# EAGLE schematic Trackerv4 (EAGLE 9.4.2)

## Sheet 1 of 5: Main MCU
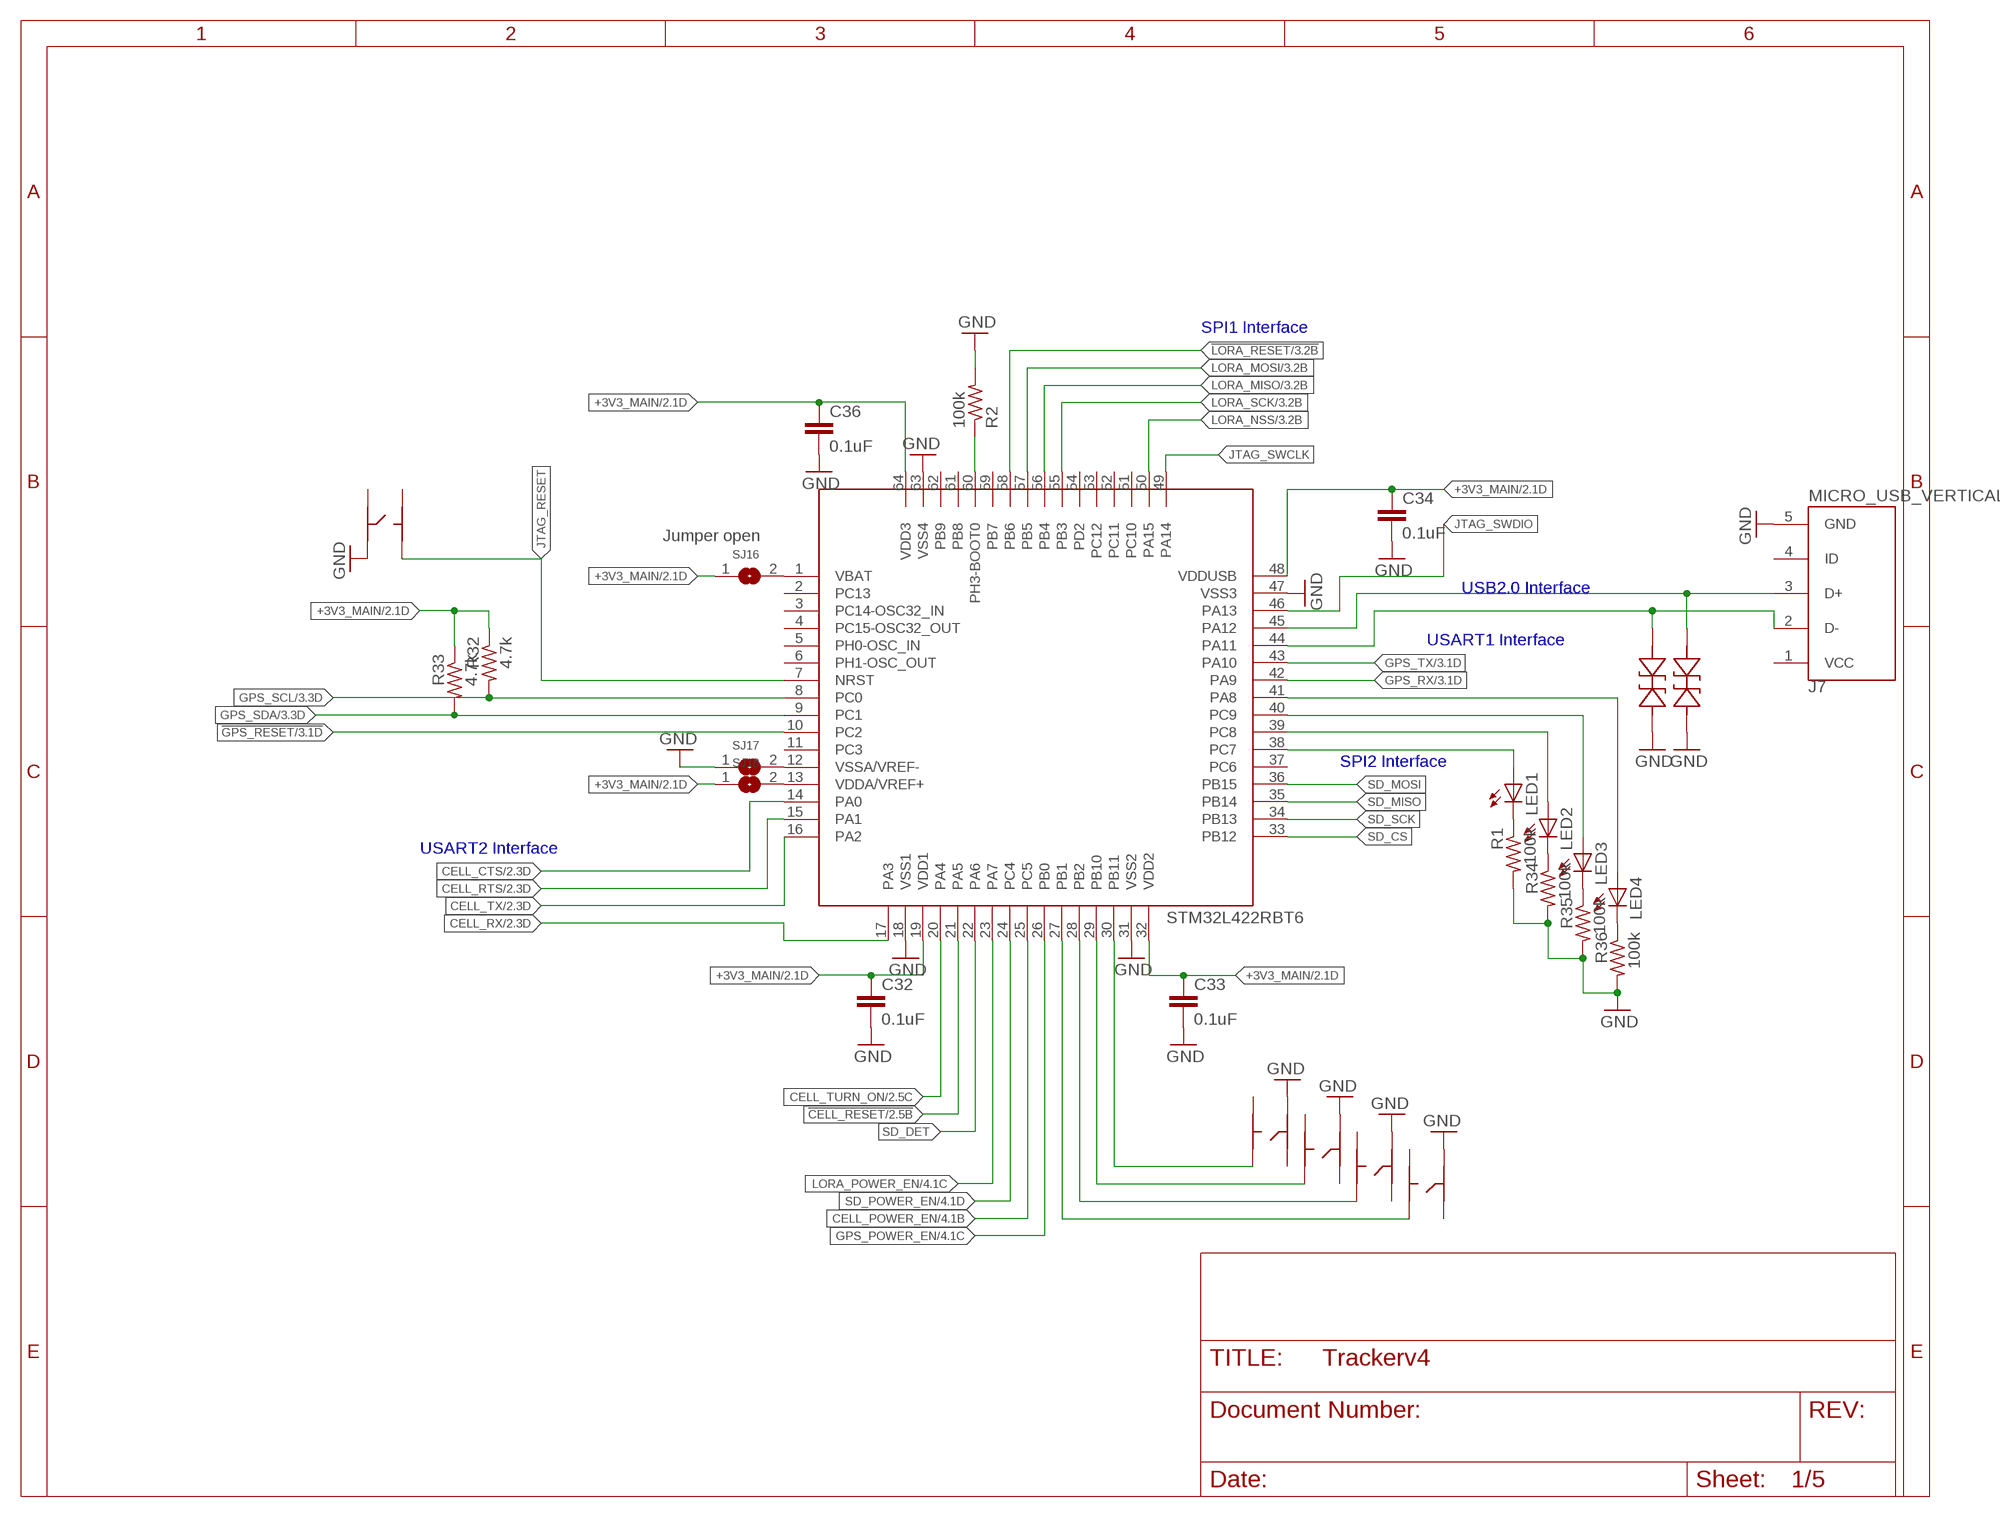
[diagram p0: schematic, sheet 1]

### Parts
C32  0.1uF  C-EUC0402  [C0402]
C33  0.1uF  C-EUC0402  [C0402]
C34  0.1uF  C-EUC0402  [C0402]
C36  0.1uF  C-EUC0402  [C0402]
CR7  PESD0402-140  [PESD0402]
CR8  PESD0402-140  [PESD0402]
J7  MICRO_USB_VERTICAL  [MICRO_USB_VERTICAL]
LED1  LEDCHIP-LED0603  [CHIP-LED0603]
LED2  LEDCHIP-LED0603  [CHIP-LED0603]
LED3  LEDCHIP-LED0603  [CHIP-LED0603]
LED4  LEDCHIP-LED0603  [CHIP-LED0603]
R1  100k  R-US_R0402  [R0402]
R2  100k  R-US_R0402  [R0402]
R32  4.7k  R-US_R0402  [R0402]
R33  4.7k  R-US_R0402  [R0402]
R34  100k  R-US_R0402  [R0402]
R35  100k  R-US_R0402  [R0402]
R36  100k  R-US_R0402  [R0402]
S1  KMR731NG  [KMR731NG]
S2  KMR731NG  [KMR731NG]
S3  KMR731NG  [KMR731NG]
S4  KMR731NG  [KMR731NG]
S5  KMR731NG  [KMR731NG]
SJ16  SOLDERJUMPERREFLOW_NOPASTE  [SOLDERJUMPER_REFLOW_NOPASTE]
SJ17  SOLDERJUMPERREFLOW_NOPASTE  [SOLDERJUMPER_REFLOW_NOPASTE]
SJ18  SOLDERJUMPERREFLOW_NOPASTE  [SOLDERJUMPER_REFLOW_NOPASTE]
U$1  STM32L422RBT6  [QFP50P1200X1200X160-64]

### Nets
!CELL_RESET: U$1.21(PA5) ; also sheet 2
!GPS_RESET: U$1.10(PC2) ; also sheet 3
!LORA_RESET: U$1.58(PB6) ; also sheet 3,5
+3V3_MAIN: C32.1 C33.1 C34.1 C36.1 R32.1 R33.1 SJ16.1 SJ18.1 U$1.19(VDD1) U$1.32(VDD2) U$1.48(VDDUSB) U$1.64(VDD3) ; also sheet 2,4,5
CELL_CTS: U$1.14(PA0) ; also sheet 2,5
CELL_POWER_EN: U$1.25(PC5) ; also sheet 4
CELL_RTS: U$1.15(PA1) ; also sheet 2,5
CELL_RX: U$1.17(PA3) ; also sheet 2,5
CELL_TURN_ON: U$1.20(PA4) ; also sheet 2
CELL_TX: U$1.16(PA2) ; also sheet 2,5
GND: C32.2 C33.2 C34.2 C36.2 CR7.1 CR8.1 J7.5(GND) R1.2 R2.2 R34.2 R35.2 R36.2 S1.P$1 S2.P$1 S3.P$1 S4.P$1 S5.P$1 SJ17.1 U$1.18(VSS1) U$1.31(VSS2) U$1.47(VSS3) U$1.63(VSS4) ; also sheet 2,3,4,5
GPS_POWER_EN: U$1.26(PB0) ; also sheet 4
GPS_RX: U$1.42(PA9) ; also sheet 3,5
GPS_SCL: R32.2 U$1.8(PC0) ; also sheet 3,5
GPS_SDA: R33.2 U$1.9(PC1) ; also sheet 3,5
GPS_TX: U$1.43(PA10) ; also sheet 3,5
JTAG_RESET: S1.P$4 U$1.7(NRST) ; also sheet 5
JTAG_SWCLK: U$1.49(PA14) ; also sheet 5
JTAG_SWDIO: U$1.46(PA13) ; also sheet 5
LORA_MISO: U$1.56(PB4) ; also sheet 3,5
LORA_MOSI: U$1.57(PB5) ; also sheet 3,5
LORA_NSS: U$1.50(PA15) ; also sheet 3,5
LORA_POWER_EN: U$1.23(PA7) ; also sheet 4
LORA_SCK: U$1.55(PB3) ; also sheet 3,5
MCU_USB_N [diff]: CR7.2 J7.2(D-) U$1.44(PA11)
MCU_USB_P [diff]: CR8.2 J7.3(D+) U$1.45(PA12)
N$1: R2.1 U$1.60(PH3-BOOT0)
N$68: SJ16.2 U$1.1(VBAT)
N$69: SJ17.2 U$1.12(VSSA/VREF-)
N$70: SJ18.2 U$1.13(VDDA/VREF+)
N$83: S5.P$3 U$1.27(PB1)
N$84: S4.P$3 U$1.28(PB2)
N$85: S3.P$3 U$1.29(PB10)
N$86: S2.P$3 U$1.30(PB11)
N$87: LED1.C R1.1
N$88: LED2.C R34.1
N$89: LED3.C R35.1
N$90: LED4.C R36.1
N$92: LED1.A U$1.38(PC7)
N$93: LED2.A U$1.39(PC8)
N$94: LED3.A U$1.40(PC9)
N$95: LED4.A U$1.41(PA8)
SD_CS: U$1.33(PB12) ; also sheet 2
SD_DET: U$1.22(PA6) ; also sheet 2
SD_MISO: U$1.35(PB14) ; also sheet 2
SD_MOSI: U$1.36(PB15) ; also sheet 2
SD_POWER_EN: U$1.24(PC4) ; also sheet 4
SD_SCK: U$1.34(PB13) ; also sheet 2
Unconnected: J7.1(VCC) J7.4(ID) S1.P$2 S1.P$3 S2.P$2 S2.P$4 S3.P$2 S3.P$4 S4.P$2 S4.P$4 S5.P$2 S5.P$4 U$1.2(PC13) U$1.3(PC14-OSC32_IN) U$1.4(PC15-OSC32_OUT) U$1.5(PH0-OSC_IN) U$1.6(PH1-OSC_OUT) U$1.11(PC3) U$1.37(PC6) U$1.51(PC10) U$1.52(PC11) U$1.53(PC12) U$1.54(PD2) U$1.59(PB7) U$1.61(PB8) U$1.62(PB9)

### Notes on the sheet
- SPI1 Interface
- Jumper open
- USB2.0 Interface
- USART1 Interface
- SPI2 Interface
- USART2 Interface

## Sheet 2 of 5: Cellular
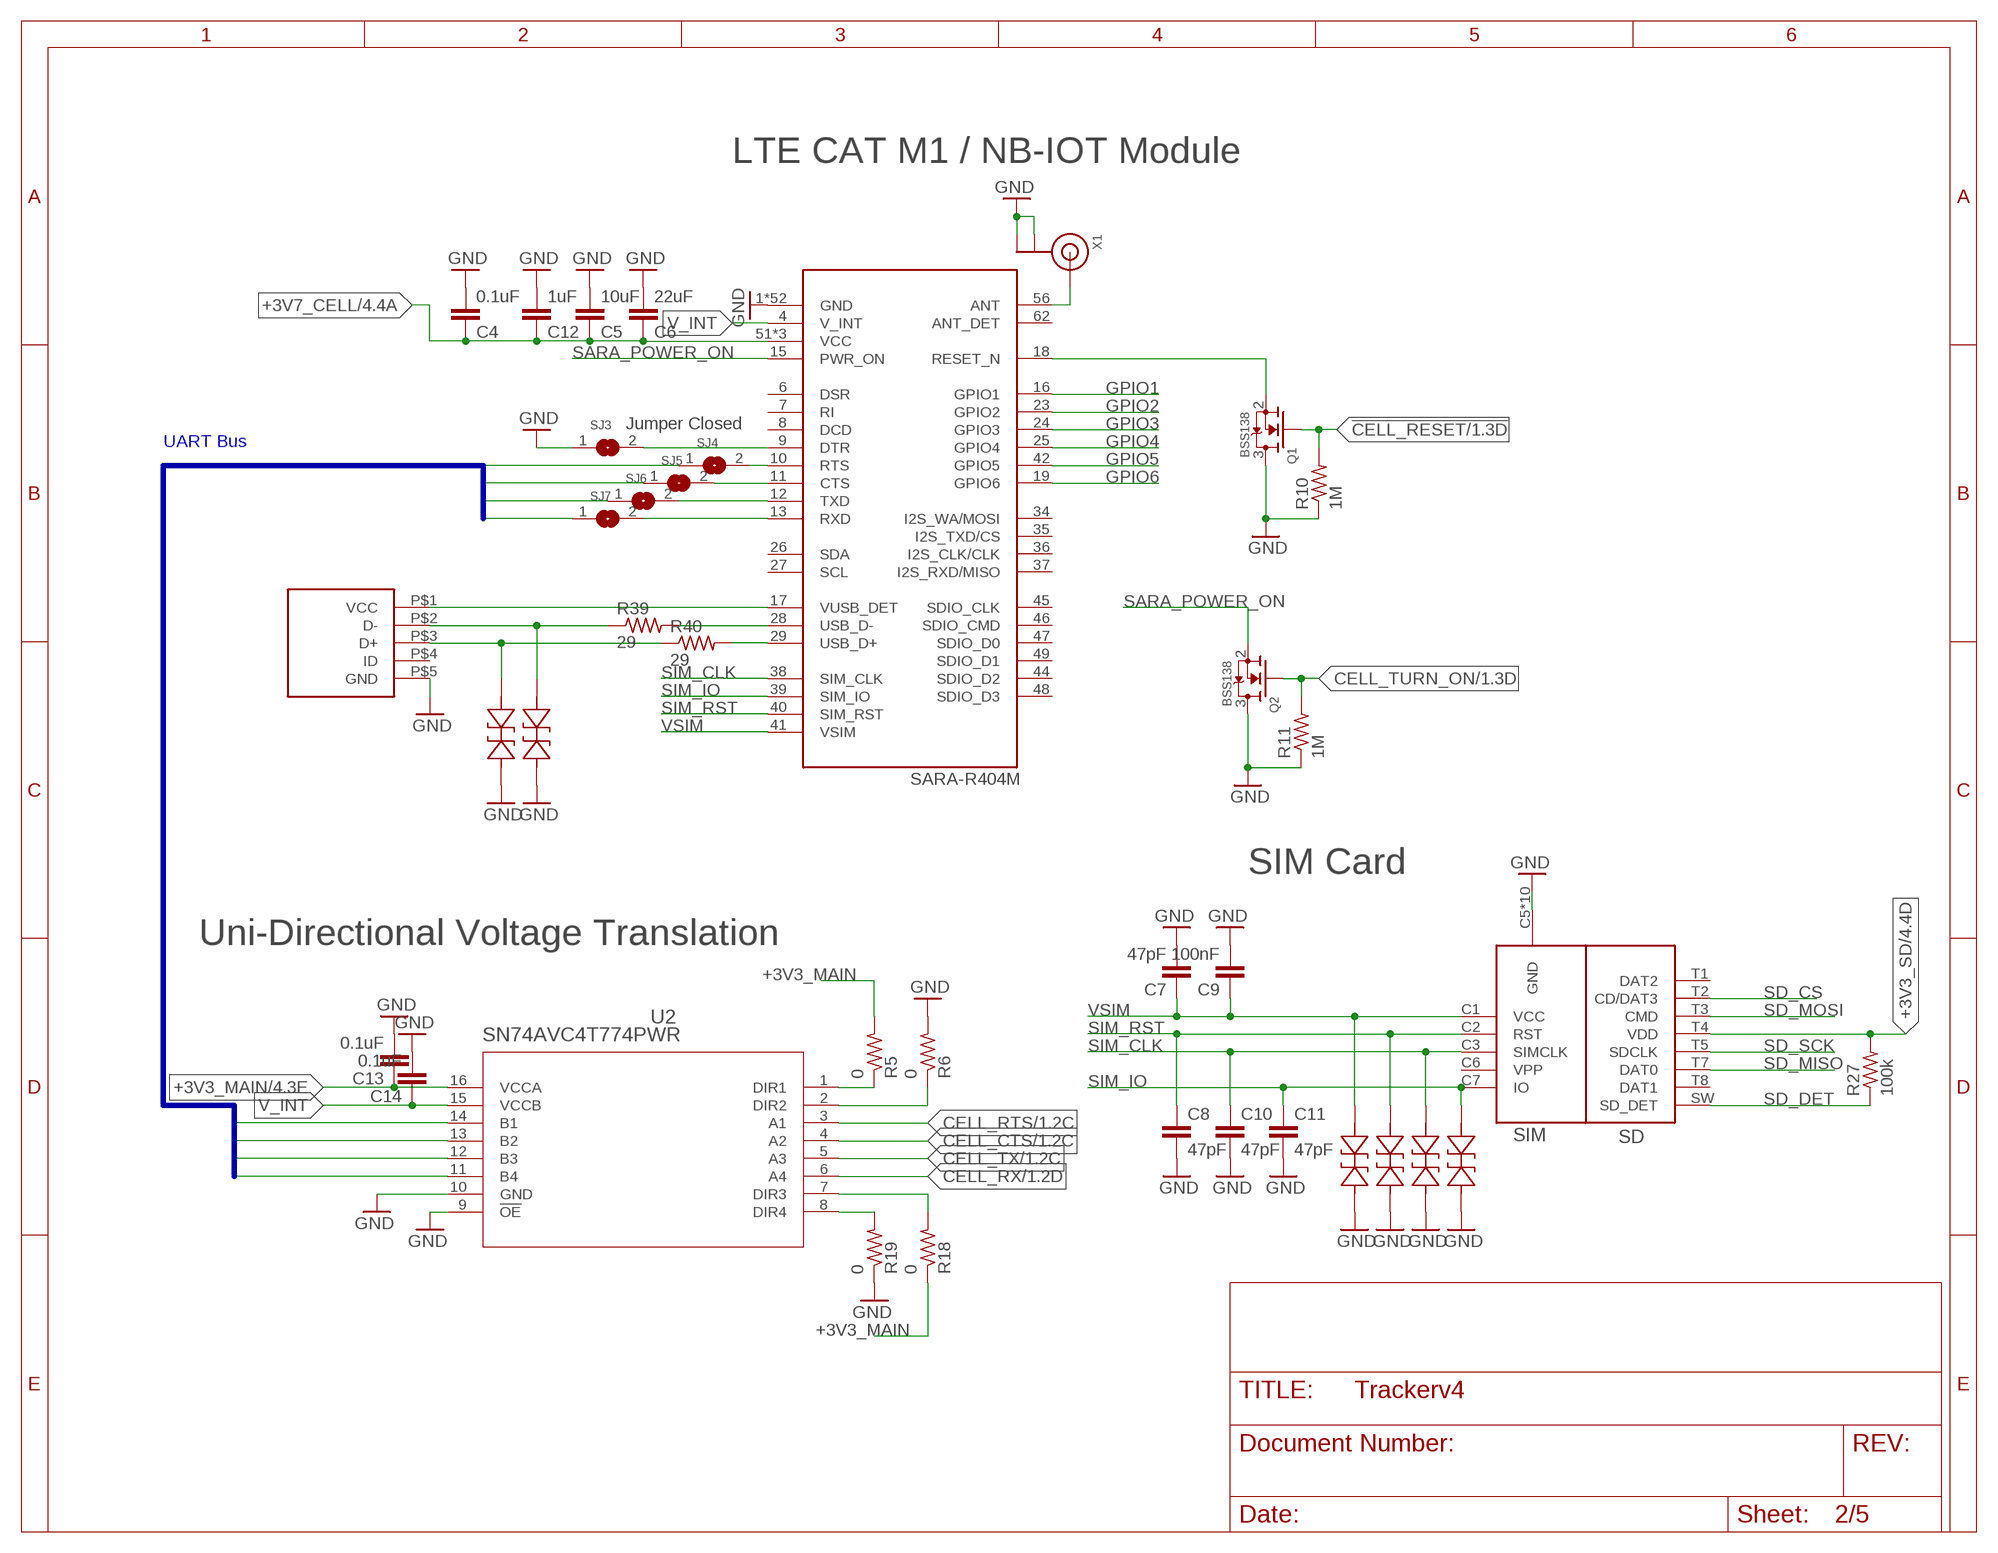
[diagram p1: schematic, sheet 2]

### Parts
C4  0.1uF  C-EUC0402  [C0402]
C5  10uF  C-EUC0603  [C0603]
C6  22uF  C-EUC0805  [C0805]
C7  47pF  C-EUC0402  [C0402]
C8  47pF  C-EUC0402  [C0402]
C9  100nF  C-EUC0402  [C0402]
C10  47pF  C-EUC0402  [C0402]
C11  47pF  C-EUC0402  [C0402]
C12  1uF  C-EUC0402  [C0402]
C13  0.1uF  C-EUC0402  [C0402]
C14  0.1uF  C-EUC0402  [C0402]
CR1  PESD0402-140  [PESD0402]
CR2  PESD0402-140  [PESD0402]
CR3  PESD0402-140  [PESD0402]
CR4  PESD0402-140  [PESD0402]
CR5  PESD0402-140  [PESD0402]
CR6  PESD0402-140  [PESD0402]
Q1  BSS138  [SOT23-3]
Q2  BSS138  [SOT23-3]
R5  0  R-US_R0402  [R0402]
R6  0  R-US_R0402  [R0402]
R10  1M  R-US_R0402  [R0402]
R11  1M  R-US_R0402  [R0402]
R18  0  R-US_R0402  [R0402]
R19  0  R-US_R0402  [R0402]
R27  100k  R-US_R0402  [R0402]
R39  29  R-US_R0402  [R0402]
R40  29  R-US_R0402  [R0402]
SJ3  SOLDERJUMPERCLOSED  [SOLDERJUMPER_CLOSEDWIRE]
SJ4  SOLDERJUMPERCLOSED  [SOLDERJUMPER_CLOSEDWIRE]
SJ5  SOLDERJUMPERCLOSED  [SOLDERJUMPER_CLOSEDWIRE]
SJ6  SOLDERJUMPERCLOSED  [SOLDERJUMPER_CLOSEDWIRE]
SJ7  SOLDERJUMPERCLOSED  [SOLDERJUMPER_CLOSEDWIRE]
U2  SN74AVC4T774PWR  [PW16]
U6  SARA-R404M  [SARA-R404M]
U$5  SIM_SD_MOLEX  [SIM_SD_MOLEX]
U$6  MICRO_USB  [MOLEX_USB]
X1  ANTENNA_U.FL  [U.FL]

### Nets
!CELL_RESET: Q1.1(G) R10.2 ; also sheet 1
+3V3_MAIN: C13.1 R5.2 R18.1 U2.16(VCCA) ; also sheet 1,4,5
+3V3_SD: R27.2 U$5.T4(VDD) ; also sheet 4,5
+3V7_CELL: C4.1 C5.1 C6.1 C12.1 U6.51(VCC) U6.52(VCC) U6.53(VCC) ; also sheet 4,5
CELL_CTS: U2.4(A2) ; also sheet 1,5
CELL_D_N [diff]: CR6.2 R39.1 U$6.P$2(D-)
CELL_D_P [diff]: CR5.2 R40.1 U$6.P$3(D+)
CELL_RTS: U2.3(A1) ; also sheet 1,5
CELL_RX: U2.6(A4) ; also sheet 1,5
CELL_TURN_ON: Q2.1(G) R11.2 ; also sheet 1
CELL_TX: U2.5(A3) ; also sheet 1,5
GND: C4.2 C5.2 C6.2 C7.2 C8.2 C9.2 C10.2 C11.2 C12.2 C13.2 C14.2 CR1.1 CR2.1 CR3.1 CR4.1 CR5.1 CR6.1 Q1.3(D) Q2.3(D) R6.2 R10.1 R11.1 R19.1 SJ3.1 U2.9(!OE) U2.10(GND) U6.1(GND) U6.3(GND) U6.5(GND) U6.14(GND) U6.20(GND) U6.21(GND) U6.22(GND) U6.30(GND) U6.32(GND) U6.43(GND) U6.50(GND) U6.54(GND) U6.55(GND) U6.57(GND) U6.58(GND) U6.59(GND) U6.60(GND) U6.61(GND) U6.63(GND) U6.64(GND) U6.65(GND) U6.66(GND) U6.67(GND) U6.68(GND) U6.69(GND) U6.70(GND) U6.71(GND) U6.72(GND) U6.73(GND) U6.74(GND) U6.75(GND) U6.76(GND) U6.77(GND) U6.78(GND) U6.79(GND) U6.80(GND) U6.81(GND) U6.82(GND) U6.83(GND) U6.84(GND) U6.85(GND) U6.86(GND) U6.87(GND) U6.88(GND) U6.89(GND) U6.90(GND) U6.91(GND) U6.92(GND) U6.93(GND) U6.94(GND) U6.95(GND) U6.96(GND) U$5.C5(GND) U$5.G1(GND) U$5.G2(GND) U$5.G3(GND) U$5.G4(GND) U$5.G5(GND) U$5.G6(GND) U$5.G7(GND) U$5.G8(GND) U$5.T6(GND) U$6.P$5(GND) X1.1(GND) X1.2(GND) ; also sheet 1,3,4,5
GPIO1: U6.16(GPIO1) ; also sheet 5
GPIO2: U6.23(GPIO2) ; also sheet 5
GPIO3: U6.24(GPIO3) ; also sheet 5
GPIO4: U6.25(GPIO4) ; also sheet 5
GPIO5: U6.42(GPIO5) ; also sheet 5
GPIO6: U6.19(GPIO6) ; also sheet 5
N$6: U6.17(VUSB_DET) U$6.P$1(VCC)
N$7: SJ6.2 U6.12(TXD)
N$8: SJ7.2 U6.13(RXD)
N$12: Q1.2(S) U6.18(RESET_N)
N$13: U6.56(ANT) X1.3(SIGNAL)
N$16: SJ3.2 U6.9(DTR)
N$18: SJ5.2 U6.11(CTS)
N$19: SJ4.2 U6.10(RTS)
N$20: R6.1 U2.2(DIR2)
N$31: R5.1 U2.1(DIR1)
N$32: R18.2 U2.7(DIR3)
N$33: R19.2 U2.8(DIR4)
N$54_N [diff]: R39.2 U6.28(USB_D-)
N$54_P [diff]: R40.2 U6.29(USB_D+)
SARA_CTS: SJ5.1 U2.13(B2)
SARA_POWER_ON: Q2.2(S) U6.15(PWR_ON)
SARA_RTS: SJ4.1 U2.14(B1)
SARA_RX: SJ7.1 U2.11(B4)
SARA_TX: SJ6.1 U2.12(B3)
SD_CS: U$5.T2(CD/DAT3) ; also sheet 1
SD_DET: R27.1 U$5.SW(SD_DET) ; also sheet 1
SD_MISO: U$5.T7(DAT0) ; also sheet 1
SD_MOSI: U$5.T3(CMD) ; also sheet 1
SD_SCK: U$5.T5(SDCLK) ; also sheet 1
SIM_CLK: C10.1 CR3.2 U6.38(SIM_CLK) U$5.C3(SIMCLK)
SIM_IO: C11.1 CR4.2 U6.39(SIM_IO) U$5.C7(IO)
SIM_RST: C8.1 CR2.2 U6.40(SIM_RST) U$5.C2(RST)
V_INT: C14.1 U2.15(VCCB) U6.4(V_INT)
VSIM: C7.1 C9.1 CR1.2 U6.41(VSIM) U$5.C1(VCC)
Unconnected: U6.6(DSR) U6.7(RI) U6.8(DCD) U6.26(SDA) U6.27(SCL) U6.34(I2S_WA/MOSI) U6.35(I2S_TXD/CS) U6.36(I2S_CLK/CLK) U6.37(I2S_RXD/MISO) U6.44(SDIO_D2) U6.45(SDIO_CLK) U6.46(SDIO_CMD) U6.47(SDIO_D0) U6.48(SDIO_D3) U6.49(SDIO_D1) U6.62(ANT_DET) U$5.C6(VPP) U$5.T1(DAT2) U$5.T8(DAT1) U$6.P$4(ID)

### Buses
UART_FLOW:SARA_CTS,SARA_RTS,SARA_RX,SARA_TX

### Notes on the sheet
- LTE CAT M1 / NB-IOT Module
- Jumper Closed
- UART Bus
- SIM Card
- Uni-Directional Voltage Translation

## Sheet 3 of 5: LoRa & GPS
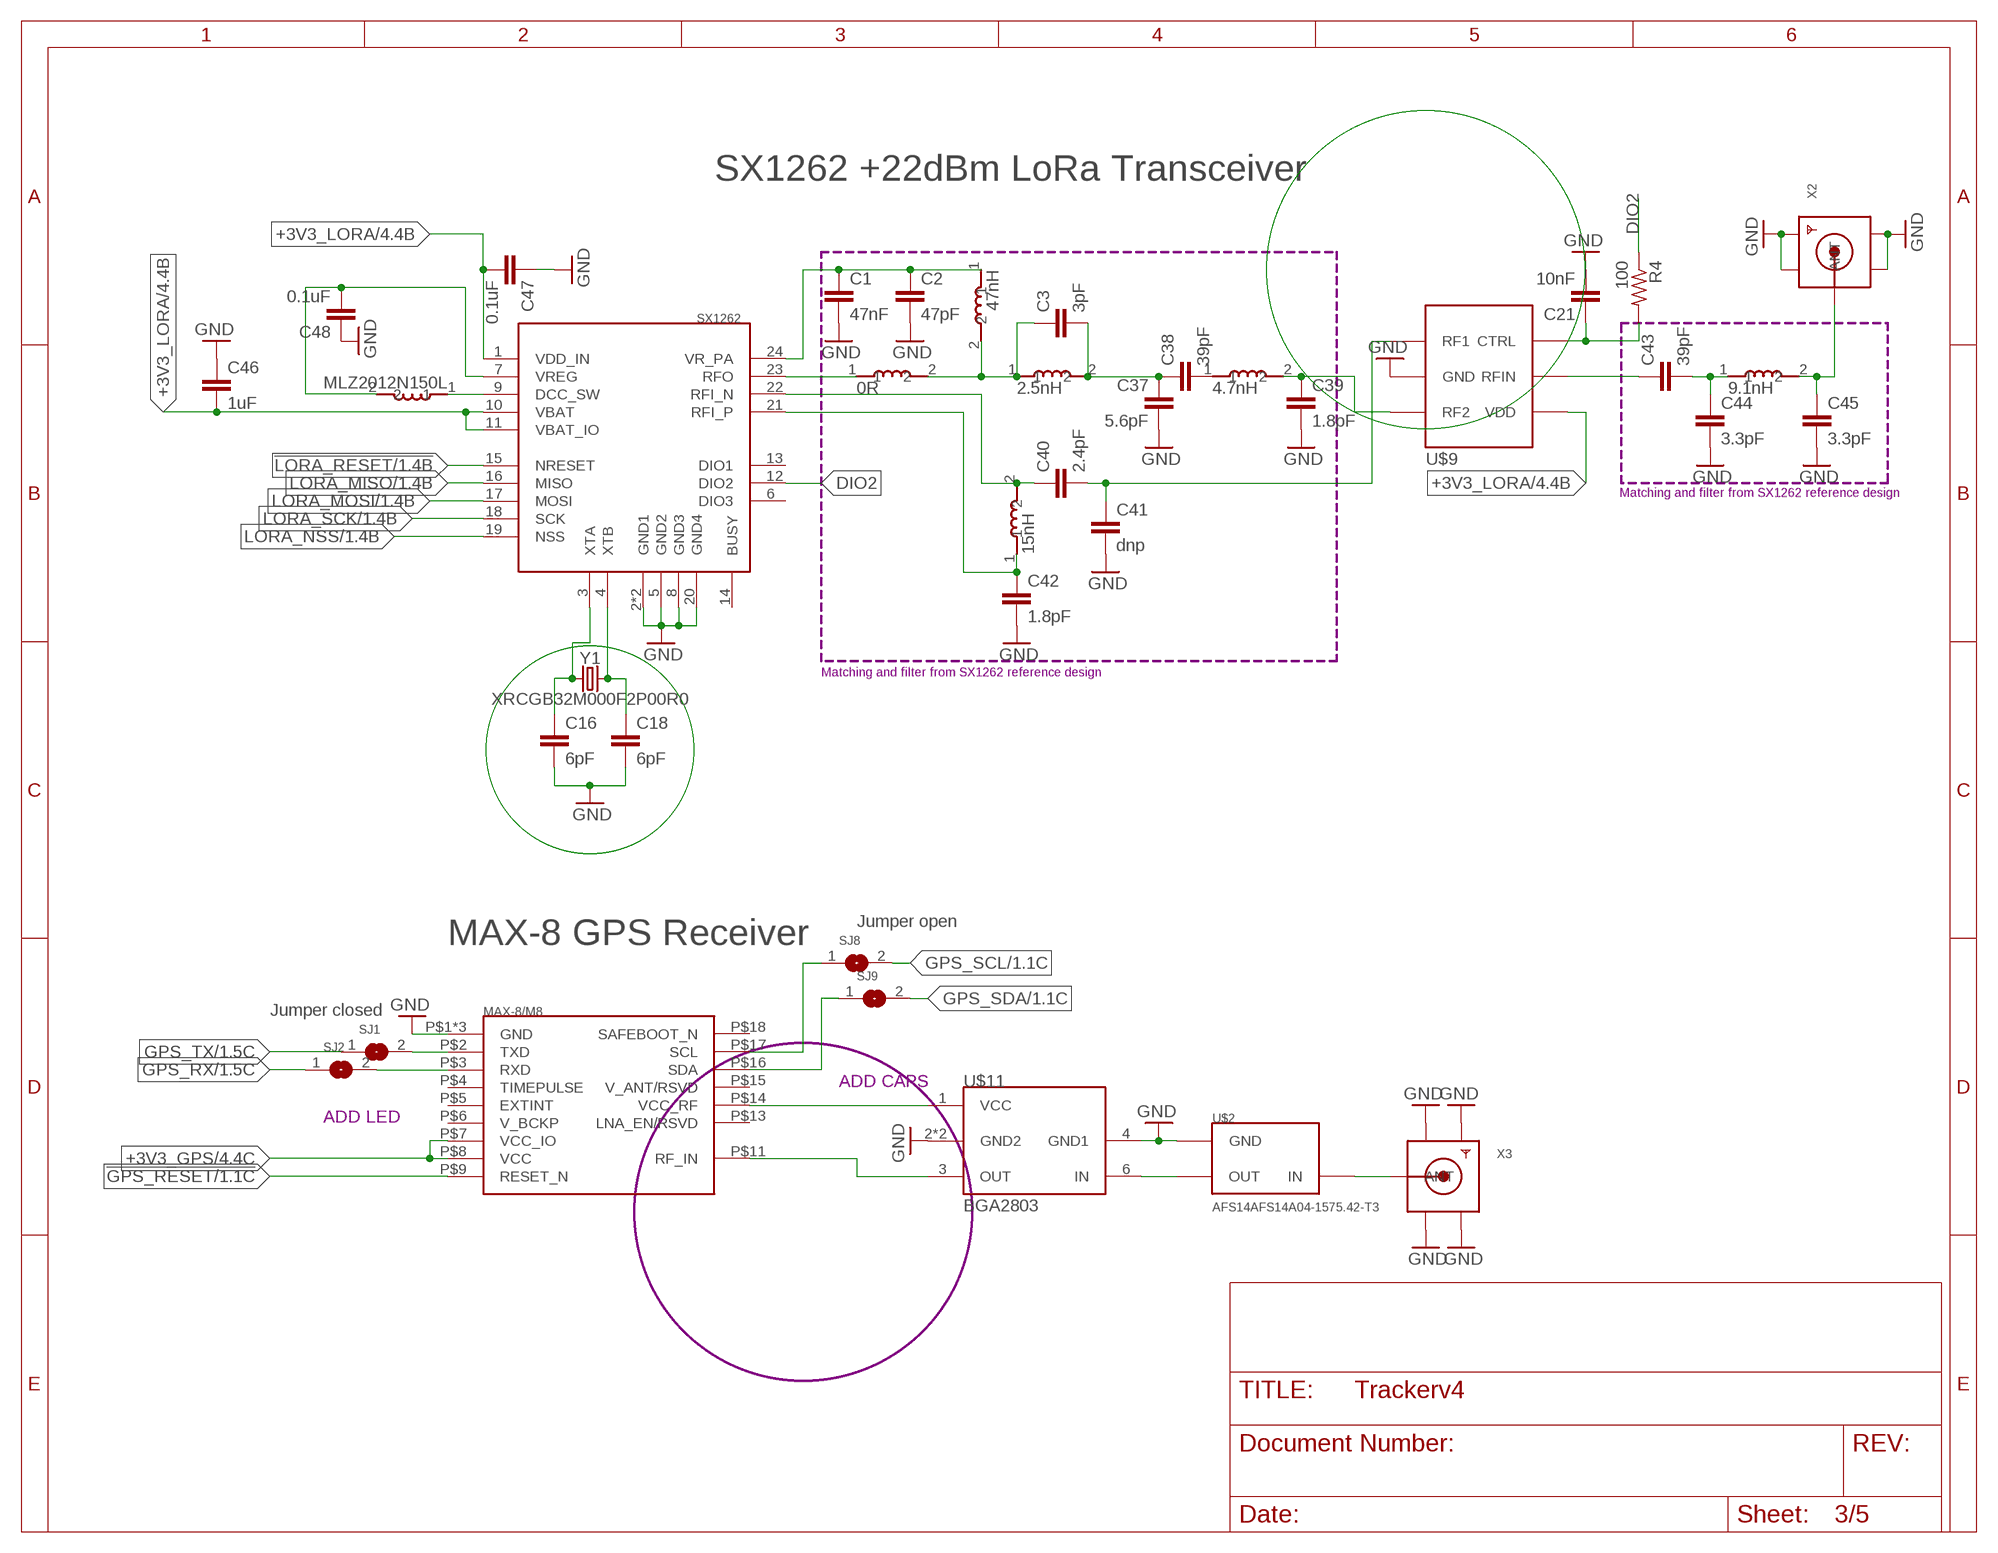
[diagram p2: schematic, sheet 3]

### Parts
C1  47nF  C-EUC0402  [C0402]
C2  47pF  C-EUC0402  [C0402]
C3  3pF  C-EUC0402  [C0402]
C16  6pF  C-EUC0402  [C0402]
C18  6pF  C-EUC0402  [C0402]
C21  10nF  C-EUC0402  [C0402]
C37  5.6pF  C-EUC0402  [C0402]
C38  39pF  C-EUC0402  [C0402]
C39  1.8pF  C-EUC0402  [C0402]
C40  2.4pF  C-EUC0402  [C0402]
C41  dnp  C-EUC0402  [C0402]
C42  1.8pF  C-EUC0402  [C0402]
C43  39pF  C-EUC0402  [C0402]
C44  3.3pF  C-EUC0402  [C0402]
C45  3.3pF  C-EUC0402  [C0402]
C46  1uF  C-EUC0603  [C0603]
C47  0.1uF  C-EUC0402  [C0402]
C48  0.1uF  C-EUC0402  [C0402]
R4  100  R-US_R0402  [R0402]
SJ1  SOLDERJUMPERCLOSED  [SOLDERJUMPER_CLOSEDWIRE]
SJ2  SOLDERJUMPERCLOSED  [SOLDERJUMPER_CLOSEDWIRE]
SJ8  SOLDERJUMPERREFLOW  [SOLDERJUMPER_REFLOW]
SJ9  SOLDERJUMPERREFLOW  [SOLDERJUMPER_REFLOW]
U$2  AFS14AFS14A04-1575.42-T3  [AFS14]
U$3  MLZ2012N150L  INDUCTOR0805  [C0805]
U$7  SX1262  [QFN50P400X400X100-25T260]
U$8  MAX-8/M8  [MAX-8-M8]
U$9  BGS12SN6E6327XTSA1  [TSNP-6-8]
U$10  47nH  INDUCTOR0402  [0402]
U$11  BGA2803  [SOT363_6SOIC]
U$12  2.5nH  INDUCTOR0402  [0402]
U$13  4.7nH  INDUCTOR0402  [0402]
U$14  15nH  INDUCTOR0402  [0402]
U$15  9.1nH  INDUCTOR0402  [0402]
U$16  0R  INDUCTOR0402  [0402]
X2  SMACONNECTOR_EDGE  [SMA_EDGELAUNCH]
X3  SMACONNECTOR_EDGE_UFL  [SMA_EDGELAUNCH_UFL]
Y1  XRCGB32M000F2P00R0  CRYSTAL-32MHZ-SMD-2.0X1.6MM  [CRYSTAL-SMD-2.0X1.6MM]

### Nets
!GPS_RESET: U$8.P$9(RESET_N) ; also sheet 1
!LORA_RESET: U$7.15(NRESET) ; also sheet 1,5
+3V3_GPS: U$8.P$7(VCC_IO) U$8.P$8(VCC) ; also sheet 4,5
+3V3_LORA: C46.2 C47.2 U$7.1(VDD_IN) U$7.10(VBAT) U$7.11(VBAT_IO) U$9.P$6(VDD) ; also sheet 4,5
DIO2: R4.1 U$7.12(DIO2)
GND: C1.2 C2.2 C16.2 C18.2 C21.2 C37.2 C39.2 C41.2 C42.2 C44.2 C45.2 C46.1 C47.1 C48.1 U$2.P$2(GND) U$2.P$3(GND) U$2.P$5(GND) U$7.2(GND1) U$7.5(GND2) U$7.8(GND3) U$7.20(GND4) U$7.25(GND1) U$8.P$1(GND) U$8.P$10(GND) U$8.P$12(GND) U$9.P$2(GND) U$11.2(GND2) U$11.4(GND1) U$11.5(GND2) X2.GND@1(GND4) X2.GND@2(GND3) X2.GND@3(GND2) X2.GND@4(GND1) X3.GND@1(GND1) X3.GND@2(GND2) X3.GND@3(GND3) X3.GND@4(GND4) ; also sheet 1,2,4,5
GPS_RX: SJ2.1 ; also sheet 1,5
GPS_SCL: SJ8.2 ; also sheet 1,5
GPS_SDA: SJ9.2 ; also sheet 1,5
GPS_TX: SJ1.1 ; also sheet 1,5
LORA_MISO: U$7.16(MISO) ; also sheet 1,5
LORA_MOSI: U$7.17(MOSI) ; also sheet 1,5
LORA_NSS: U$7.19(NSS) ; also sheet 1,5
LORA_SCK: U$7.18(SCK) ; also sheet 1,5
N$4: SJ1.2 U$8.P$2(TXD)
N$5: SJ2.2 U$8.P$3(RXD)
N$14: U$3.1 U$7.9(DCC_SW)
N$15: C16.1 U$7.3(XTA) Y1.1
N$17: C18.1 U$7.4(XTB) Y1.3
N$21: C48.2 U$3.2 U$7.7(VREG)
N$27: C21.1 R4.2 U$9.P$4(CTRL)
N$29: U$8.P$11(RF_IN) U$11.3(OUT)
N$30: U$2.P$4(OUT) U$11.6(IN)
N$43: SJ8.1 U$8.P$17(SCL)
N$44: SJ9.1 U$8.P$16(SDA)
N$46: U$8.P$14(VCC_RF) U$11.1(VCC)
N$47: U$2.P$1(IN) X3.P(ANT)
N$71: C39.1 U$9.P$1(RF2) U$13.2
N$72: C42.1 U$7.21(RFI_P) U$14.1
N$73: C1.1 C2.1 U$7.24(VR_PA) U$10.1
N$74: C3.1 U$10.2 U$12.1 U$16.2
N$75: C3.2 C37.1 C38.1 U$12.2
N$76: C40.1 U$7.22(RFI_N) U$14.2
N$77: C40.2 C41.1 U$9.P$3(RF1)
N$78: C38.2 U$13.1
N$79: C43.2 C44.1 U$15.1
N$80: C45.1 U$15.2 X2.P(ANT)
N$81: C43.1 U$9.P$5(RFIN)
N$82: U$7.23(RFO) U$16.1
Unconnected: U$7.6(DIO3) U$7.13(DIO1) U$7.14(BUSY) U$8.P$4(TIMEPULSE) U$8.P$5(EXTINT) U$8.P$6(V_BCKP) U$8.P$13(LNA_EN/RSVD) U$8.P$15(V_ANT/RSVD) U$8.P$18(SAFEBOOT_N)

### Notes on the sheet
- SX1262 +22dBm LoRa Transceiver
- Matching and filter from SX1262 reference design
- Matching and filter from SX1262 reference design
- Jumper open
- MAX-8 GPS Receiver
- Jumper closed
- ADD CAPS
- ADD LED

## Sheet 4 of 5: Power
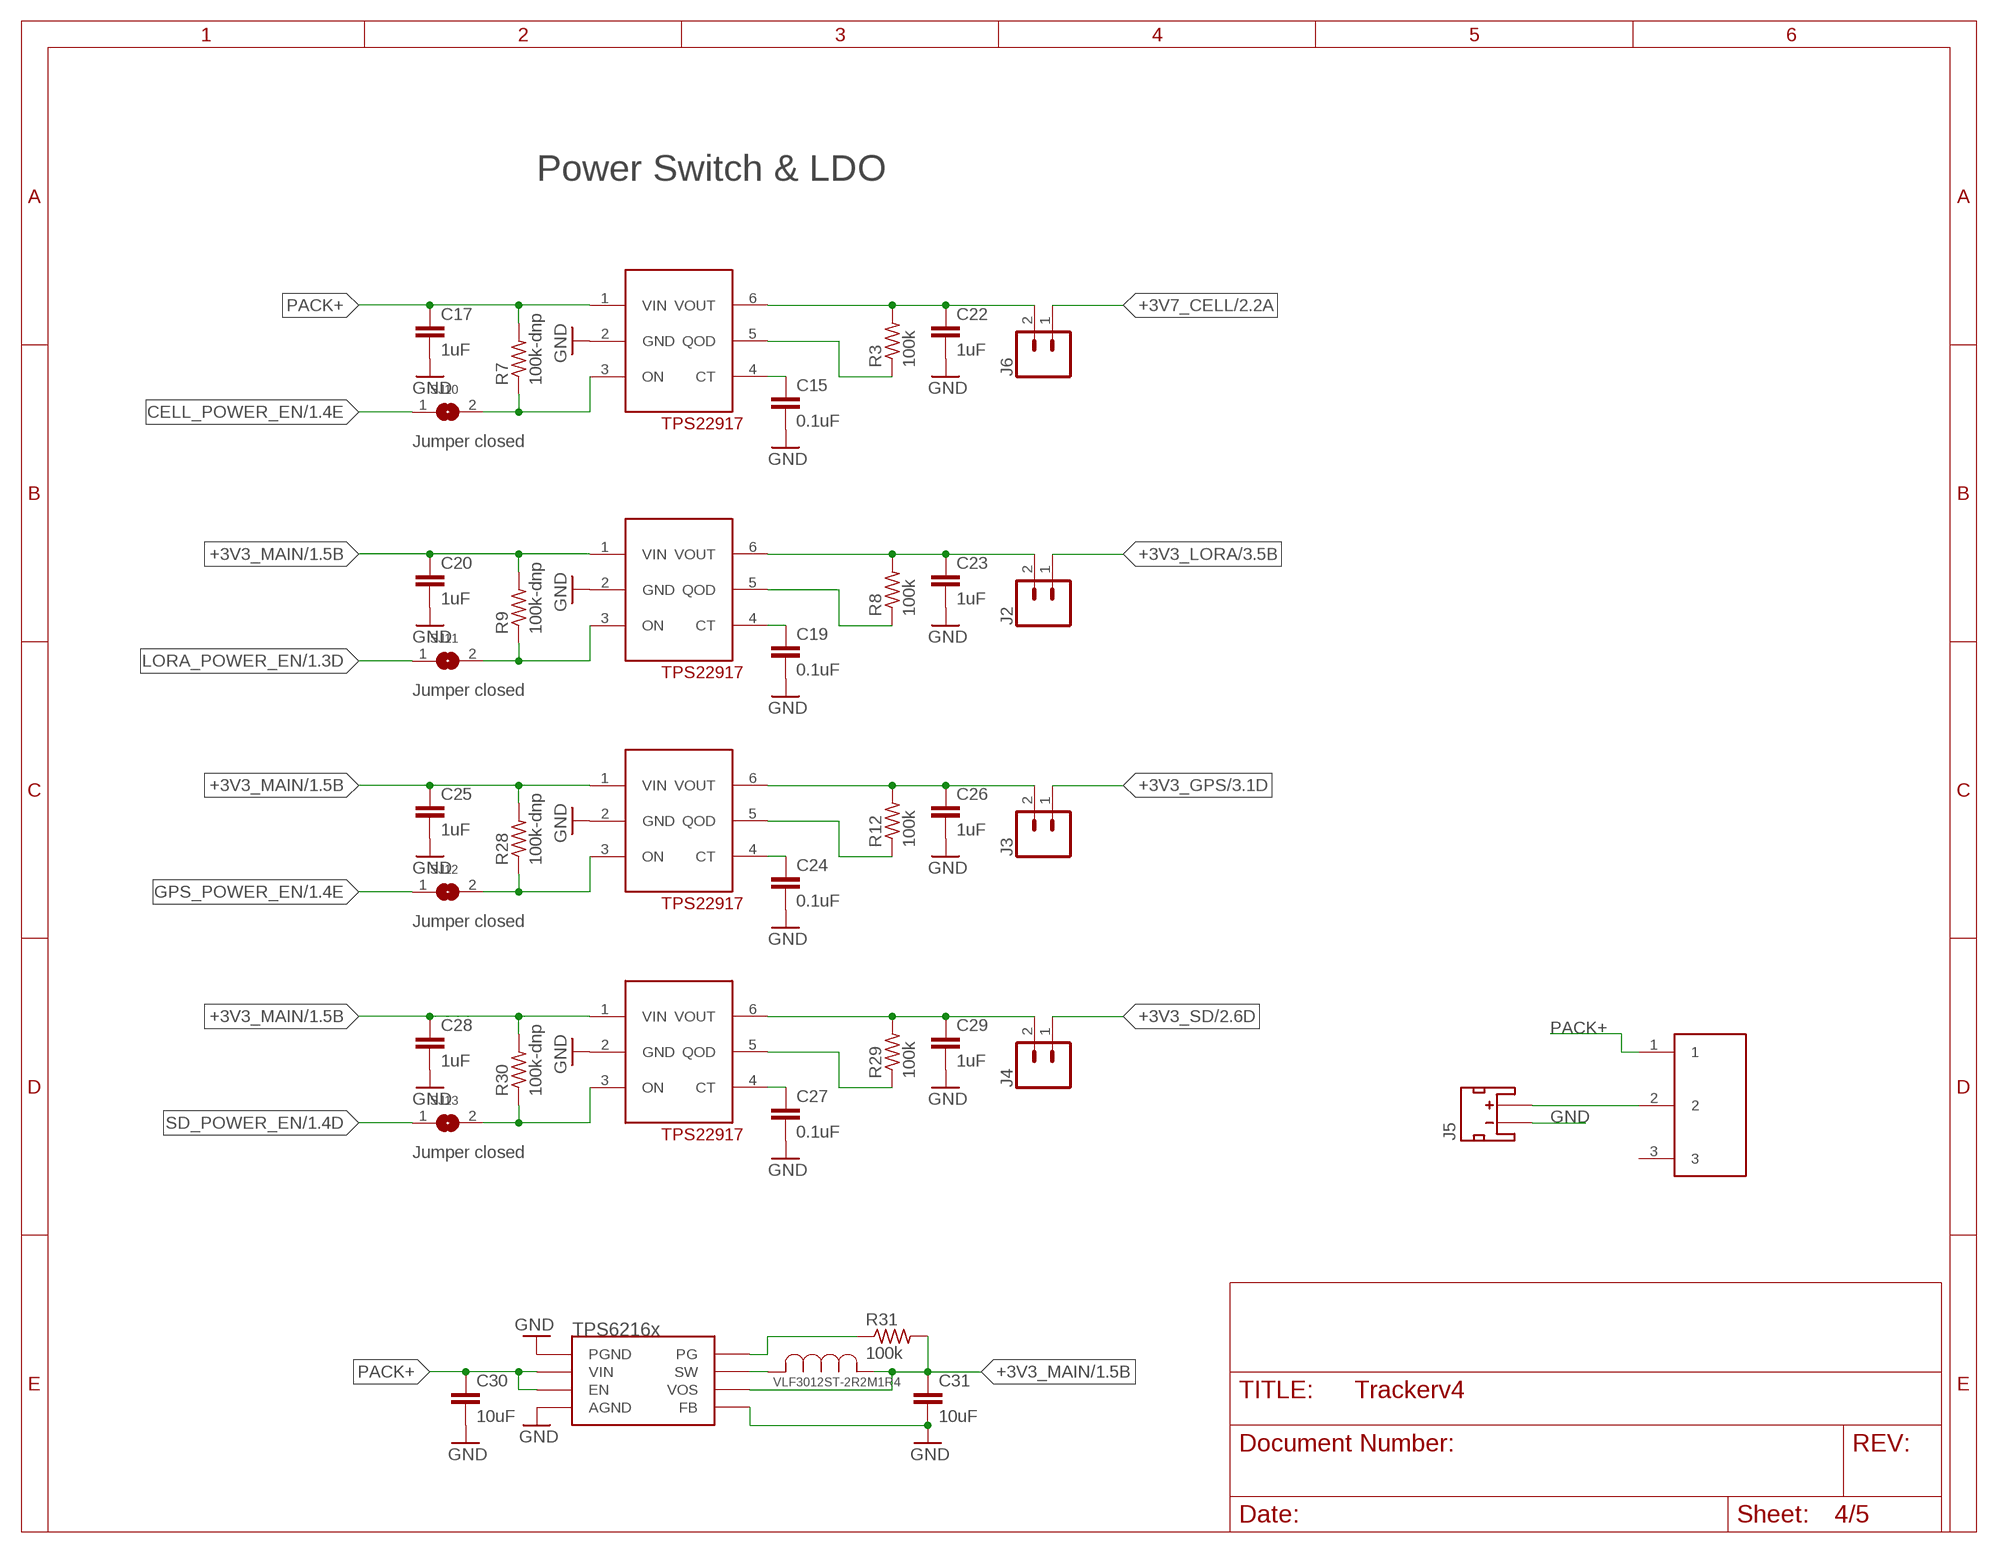
[diagram p3: schematic, sheet 4]

### Parts
C15  0.1uF  C-EUC0402  [C0402]
C17  1uF  C-EUC0402  [C0402]
C19  0.1uF  C-EUC0402  [C0402]
C20  1uF  C-EUC0402  [C0402]
C22  1uF  C-EUC0402  [C0402]
C23  1uF  C-EUC0402  [C0402]
C24  0.1uF  C-EUC0402  [C0402]
C25  1uF  C-EUC0402  [C0402]
C26  1uF  C-EUC0402  [C0402]
C27  0.1uF  C-EUC0402  [C0402]
C28  1uF  C-EUC0402  [C0402]
C29  1uF  C-EUC0402  [C0402]
C30  10uF  C-EUC0805  [C0805]
C31  10uF  C-EUC0805  [C0805]
J2  CONN_02  [1X02]
J3  CONN_02  [1X02]
J4  CONN_02  [1X02]
J5  JST_2MM_MALE  [JST-2-SMD]
J6  CONN_02  [1X02]
R3  100k  R-US_R0402  [R0402]
R7  100k-dnp  R-US_R0402  [R0402]
R8  100k  R-US_R0402  [R0402]
R9  100k-dnp  R-US_R0402  [R0402]
R12  100k  R-US_R0402  [R0402]
R28  100k-dnp  R-US_R0402  [R0402]
R29  100k  R-US_R0402  [R0402]
R30  100k-dnp  R-US_R0402  [R0402]
R31  100k  R-US_R0402  [R0402]
SJ10  SOLDERJUMPERCLOSED  [SOLDERJUMPER_CLOSEDWIRE]
SJ11  SOLDERJUMPERCLOSED  [SOLDERJUMPER_CLOSEDWIRE]
SJ12  SOLDERJUMPERCLOSED  [SOLDERJUMPER_CLOSEDWIRE]
SJ13  SOLDERJUMPERCLOSED  [SOLDERJUMPER_CLOSEDWIRE]
U1  TPS22917  [SOT23-6]
U3  TPS22917  [SOT23-6]
U4  TPS22917  [SOT23-6]
U5  TPS22917  [SOT23-6]
U14  TPS6216X  [8WSON]
U$4  VLF3012ST-2R2M1R4  [IND_3010]
U$17  SPDT_THRU  [SPDT_THRU]

### Nets
+3V3_GPS: J3.1 ; also sheet 3,5
+3V3_LORA: J2.1 ; also sheet 3,5
+3V3_MAIN: C20.1 C25.1 C28.1 C31.1 R9.2 R28.2 R30.2 R31.2 U3.1(VIN) U4.1(VIN) U5.1(VIN) U14.P$6(VOS) U$4.1 ; also sheet 1,2,5
+3V3_SD: J4.1 ; also sheet 2,5
+3V7_CELL: J6.1 ; also sheet 2,5
CELL_POWER_EN: SJ10.1 ; also sheet 1
GND: C15.2 C17.2 C19.2 C20.2 C22.2 C23.2 C24.2 C25.2 C26.2 C27.2 C28.2 C29.2 C30.2 C31.2 J5.1(-) U1.2(GND) U3.2(GND) U4.2(GND) U5.2(GND) U14.P$1(PGND) U14.P$4(AGND) U14.P$5(FB) U14.P$9(AGND) ; also sheet 1,2,3,5
GPS_POWER_EN: SJ12.1 ; also sheet 1
LORA_POWER_EN: SJ11.1 ; also sheet 1
N$9: C15.1 U1.4(CT)
N$10: R3.1 U1.5(QOD)
N$11: C19.1 U3.4(CT)
N$28: R8.1 U3.5(QOD)
N$45: R7.1 SJ10.2 U1.3(ON)
N$48: R9.1 SJ11.2 U3.3(ON)
N$49: C22.1 J6.2 R3.2 U1.6(VOUT)
N$50: C23.1 J2.2 R8.2 U3.6(VOUT)
N$51: C24.1 U4.4(CT)
N$52: R12.1 U4.5(QOD)
N$53: R28.1 SJ12.2 U4.3(ON)
N$56: C26.1 J3.2 R12.2 U4.6(VOUT)
N$57: C27.1 U5.4(CT)
N$58: R29.1 U5.5(QOD)
N$59: R30.1 SJ13.2 U5.3(ON)
N$60: C29.1 J4.2 R29.2 U5.6(VOUT)
N$61: J5.2(+) U$17.2
N$63: R31.1 U14.P$8(PG)
N$64: U14.P$7(SW) U$4.2
PACK+: C17.1 C30.1 R7.2 U1.1(VIN) U14.P$2(VIN) U14.P$3(EN) U$17.1
SD_POWER_EN: SJ13.1 ; also sheet 1
Unconnected: J5.NC1(PAD1) J5.NC2(PAD2) U$17.3

### Notes on the sheet
- Power Switch & LDO
- Jumper closed
- Jumper closed
- Jumper closed
- Jumper closed

## Sheet 5 of 5: Extra
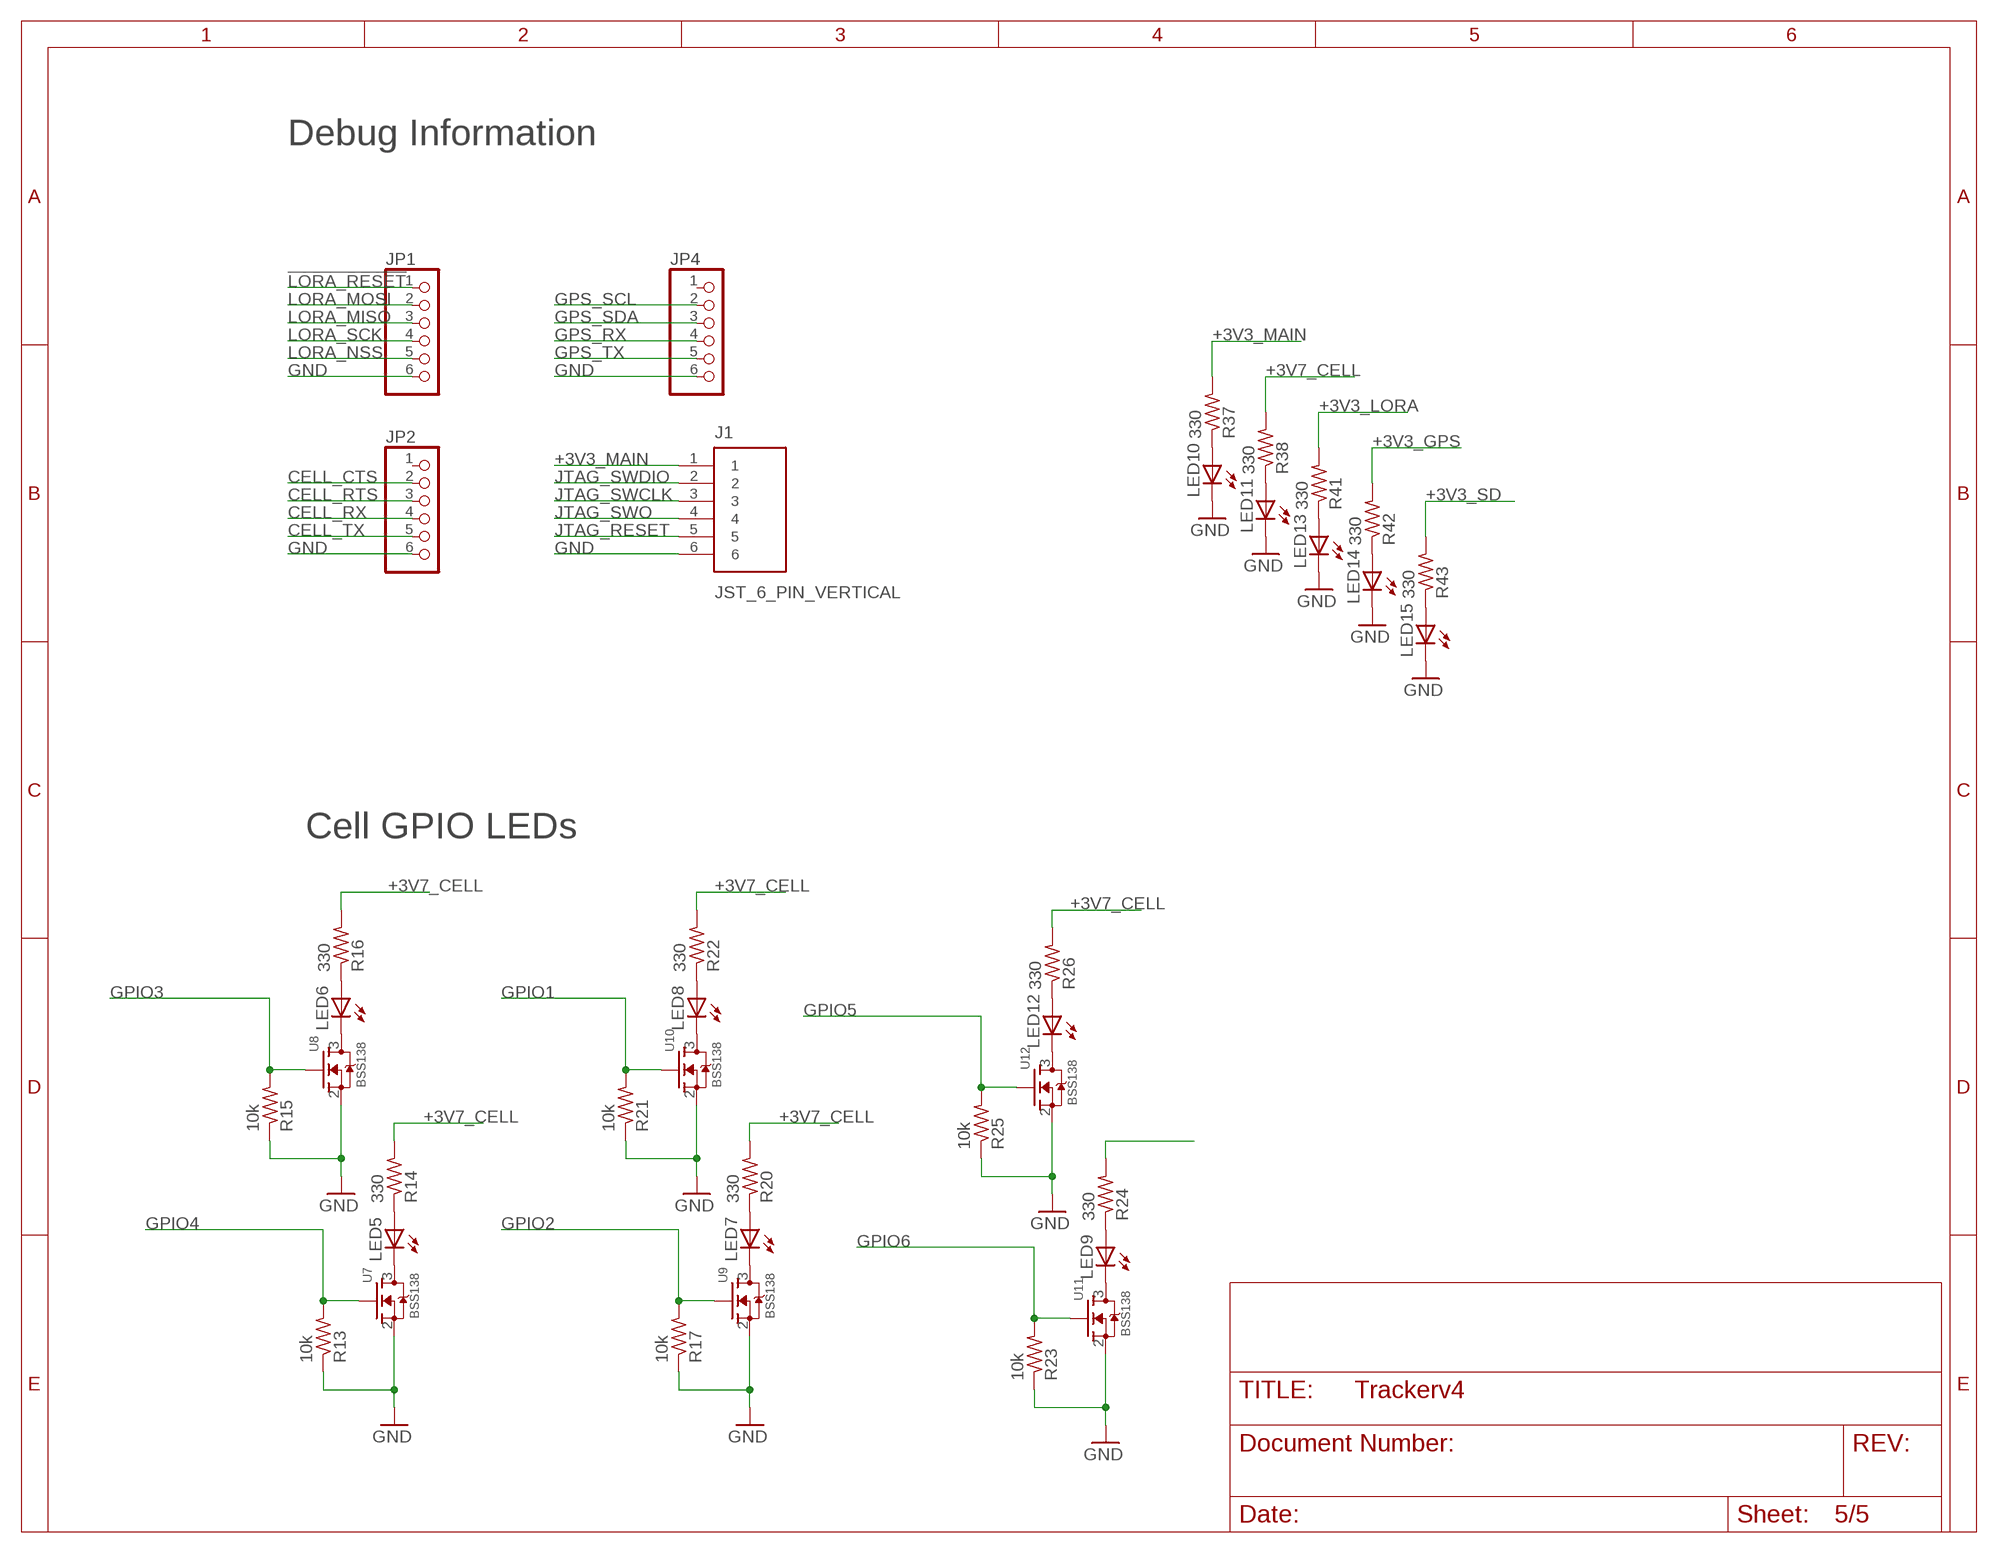
[diagram p4: schematic, sheet 5]

### Parts
J1  JST_6_PIN_VERTICAL  [JST-6-SMD-VERT-1.0MM]
JP1  PINHD-1X6  [1X06]
JP2  PINHD-1X6  [1X06]
JP4  PINHD-1X6  [1X06]
LED5  LEDCHIPLED_0603  [CHIPLED_0603]
LED6  LEDCHIPLED_0603  [CHIPLED_0603]
LED7  LEDCHIPLED_0603  [CHIPLED_0603]
LED8  LEDCHIPLED_0603  [CHIPLED_0603]
LED9  LEDCHIPLED_0603  [CHIPLED_0603]
LED10  LEDCHIPLED_0603  [CHIPLED_0603]
LED11  LEDCHIPLED_0603  [CHIPLED_0603]
LED12  LEDCHIPLED_0603  [CHIPLED_0603]
LED13  LEDCHIPLED_0603  [CHIPLED_0603]
LED14  LEDCHIPLED_0603  [CHIPLED_0603]
LED15  LEDCHIPLED_0603  [CHIPLED_0603]
R13  10k  R-US_R0402  [R0402]
R14  330  R-US_R0402  [R0402]
R15  10k  R-US_R0402  [R0402]
R16  330  R-US_R0402  [R0402]
R17  10k  R-US_R0402  [R0402]
R20  330  R-US_R0402  [R0402]
R21  10k  R-US_R0402  [R0402]
R22  330  R-US_R0402  [R0402]
R23  10k  R-US_R0402  [R0402]
R24  330  R-US_R0402  [R0402]
R25  10k  R-US_R0402  [R0402]
R26  330  R-US_R0402  [R0402]
R37  330  R-US_R0402  [R0402]
R38  330  R-US_R0402  [R0402]
R41  330  R-US_R0402  [R0402]
R42  330  R-US_R0402  [R0402]
R43  330  R-US_R0402  [R0402]
U7  BSS138  [SOT23-3]
U8  BSS138  [SOT23-3]
U9  BSS138  [SOT23-3]
U10  BSS138  [SOT23-3]
U11  BSS138  [SOT23-3]
U12  BSS138  [SOT23-3]

### Nets
!LORA_RESET: JP1.1 ; also sheet 1,3
+3V3_GPS: R42.2 ; also sheet 3,4
+3V3_LORA: R41.2 ; also sheet 3,4
+3V3_MAIN: J1.1 R37.2 ; also sheet 1,2,4
+3V3_SD: R43.2 ; also sheet 2,4
+3V7_CELL: R14.2 R16.2 R20.2 R22.2 R24.2 R26.2 R38.2 ; also sheet 2,4
CELL_CTS: JP2.2 ; also sheet 1,2
CELL_RTS: JP2.3 ; also sheet 1,2
CELL_RX: JP2.4 ; also sheet 1,2
CELL_TX: JP2.5 ; also sheet 1,2
GND: J1.6 JP1.6 JP2.6 JP4.6 LED10.C LED11.C LED13.C LED14.C LED15.C R13.1 R15.1 R17.1 R21.1 R23.1 R25.1 U7.2(S) U8.2(S) U9.2(S) U10.2(S) U11.2(S) U12.2(S) ; also sheet 1,2,3,4
GPIO1: R21.2 U10.1(G) ; also sheet 2
GPIO2: R17.2 U9.1(G) ; also sheet 2
GPIO3: R15.2 U8.1(G) ; also sheet 2
GPIO4: R13.2 U7.1(G) ; also sheet 2
GPIO5: R25.2 U12.1(G) ; also sheet 2
GPIO6: R23.2 U11.1(G) ; also sheet 2
GPS_RX: JP4.4 ; also sheet 1,3
GPS_SCL: JP4.2 ; also sheet 1,3
GPS_SDA: JP4.3 ; also sheet 1,3
GPS_TX: JP4.5 ; also sheet 1,3
JTAG_RESET: J1.5 ; also sheet 1
JTAG_SWCLK: J1.3 ; also sheet 1
JTAG_SWDIO: J1.2 ; also sheet 1
JTAG_SWO: J1.4
LORA_MISO: JP1.3 ; also sheet 1,3
LORA_MOSI: JP1.2 ; also sheet 1,3
LORA_NSS: JP1.5 ; also sheet 1,3
LORA_SCK: JP1.4 ; also sheet 1,3
N$24: LED5.C U7.3(D)
N$25: LED5.A R14.1
N$26: LED6.C U8.3(D)
N$34: LED6.A R16.1
N$35: LED7.C U9.3(D)
N$36: LED7.A R20.1
N$37: LED8.C U10.3(D)
N$38: LED8.A R22.1
N$39: LED9.C U11.3(D)
N$40: LED9.A R24.1
N$41: LED12.C U12.3(D)
N$42: LED12.A R26.1
N$62: LED10.A R37.1
N$65: LED11.A R38.1
N$66: LED13.A R41.1
N$67: LED14.A R42.1
N$91: LED15.A R43.1
Unconnected: JP2.1 JP4.1

### Notes on the sheet
- Debug Information
- Cell GPIO LEDs

## Library data of the parts
C1-C34 C36-C48 = rcl:C-EU: CAPACITOR, European symbol; SPICEPREFIX: C
CR1-CR8 = Charles:PESD0402-140; MANUFACTURER_PART_NUMBER: PESD0402140; VENDOR: Tyco Electronics
J1 = SparkFun-Connectors:JST_6_PIN_VERTICAL: JST 6 pin vertical connector Here is a six pin vertical 1.0mm pitch connector. It is useful if you need something very tiny as a connection. These are not the standard JST type connectors we use on most of our boards, but are actually the much smaller JST-SH type. Here is the connector we sell at SparkFun: JST SH Vertical 6-Pin Connector - SMD <https://www.sparkfun.com/products/579> (GPS-00579) Datasheet <http://www.sparkfun.com/datasheets/GPS/EM406-SMDConnector-eSH.pdf> It was used on these SparkFun products: SparkFun GPS Breakout <https://www.sparkfun.com/products/11818> (BOB-11818) SparkFun Weather Shield <https://www.sparkfun.com/products/12081> (DEV-12081) And many, many other GPS related products.; PROD_ID: CONN-08249; SF_ID: GPS-00579
J2-J4 J6 = SparkFun-Connectors:CONN_02: Multi connection point. Often used as Generic Header-pin footprint for 0.1 inch spaced/style header connections On any of the 0.1 inch spaced packages, you can populate with these: Break Away Headers - Straight <https://www.sparkfun.com/products/116> (PRT-00116) Break Away Male Headers - Right Angle <https://www.sparkfun.com/products/553> (PRT-00553) Female Headers <https://www.sparkfun.com/products/115> (PRT-00115) Break Away Headers - Machine Pin <https://www.sparkfun.com/products/117> (PRT-00117) Break Away Female Headers - Swiss Machine Pin <https://www.sparkfun.com/products/743> (PRT-00743) For SCREWTERMINALS and SPRING TERMINALS visit here: Screw Terimnals on SparkFun.com <https://www.sparkfun.com/search/results?term=Screw+Terminals> (5mm/3.5mm/2.54mm spacing) This device is also useful as a general connection point to wire up your design to another part of your project. Our various solder wires solder well into these plated through hole pads. Hook-Up Wire - Assortment (Stranded, 22 AWG) <https://www.sparkfun.com/products/11375> (PRT-11375) Hook-Up Wire - Assortment (Solid Core, 22 AWG) <https://www.sparkfun.com/products/11367> (PRT-11367) View the entire wire category on our website here <https://www.sparkfun.com/categories/141> Special notes: Molex polarized connector foot print use with: PRT-08233 with associated crimp pins and housings. 2.54_SCREWTERM for use with PRT-10571. 3.5mm Screw Terminal footprints for PRT-08084 5mm Screw Terminal footprints for use with PRT-08432
J5 = SparkFun-Connectors:JST_2MM_MALE: JST 2MM MALE RA CONNECTOR Two pin, compact surface mount connector. Commonly used as a battery input connection point. We really like the solid locking feeling and high current rating on these small connectors. We use these all the time as battery connectors. Mates to single-cell LiPo batteries. Here is the connector we sell at SparkFun: JST Right Angle Connector - White <https://www.sparkfun.com/products/8612> (PRT-08612) Datasheet <http://www.sparkfun.com/datasheets/Prototyping/Connectors/JST-Horizontal.pdf> It was used on these SparkFun products: SparkFun MOSFET Power Controller <https://www.sparkfun.com/products/11214> (PRT-11214) SparkFun Battery Babysitter - LiPo Battery Manager <https://www.sparkfun.com/products/13777> (PRT-13777) And many, many others that required a lipo battery connection.; PROD_ID: CONN-11443; SF_ID: PRT-08612
J7 = ASSIST:MICRO_USB_VERTICAL: Micro USB connector (vertical) - This connector comes in the B form factor.; DIGI#: 732-5958-1-ND; MANF#: 614105150721; URL: https://www.digikey.com/product-detail/en/wurth-electronics-inc/614105150721/732-5958-1-ND/5047553
JP1 JP2 JP4 = pinhead:PINHD-1X6: PIN HEADER
LED1-LED15 = adafruit:LED: LED OSRAM: - CHIPLED LG R971, LG N971, LY N971, LG Q971, LY Q971, LO R971, LY R971 LH N974, LH R974 LS Q976, LO Q976, LY Q976 LO Q996 - Hyper CHIPLED LW Q18S LB Q993, LB Q99A, LB R99A - SideLED LS A670, LO A670, LY A670, LG A670, LP A670 LB A673, LV A673, LT A673, LW A673 LH A674 LY A675 LS A676, LA A676, LO A676, LY A676, LW A676 LS A679, LY A679, LG A679 - Hyper Micro SIDELED® LS Y876, LA Y876, LO Y876, LY Y876 LT Y87S - SmartLED LW L88C, LW L88S LB L89C, LB L89S, LG L890 LS L89K, LO L89K, LY L89K LS L896, LA L896, LO L896, LY L896 - TOPLED LS T670, LO T670, LY T670, LG T670, LP T670 LSG T670, LSP T670, LSY T670, LOP T670, LYG T670 LG T671, LOG T671, LSG T671 LB T673, LV T673, LT T673, LW T673 LH T674 LS T676, LA T676, LO T676, LY T676, LB T676, LH T676, LSB T676, LW T676 LB T67C, LV T67C, LT T67C, LS T67K, LO T67K, LY T67K, LW E67C LS E67B, LA E67B, LO E67B, LY E67B, LB E67C, LV E67C, LT E67C LW T67C LS T679, LY T679, LG T679 LS T770, LO T770, LY T770, LG T770, LP T770 LB T773, LV T773, LT T773, LW T773 LH T774 LS E675, LA E675, LY E675, LS T675 LS T776, LA T776, LO T776, LY T776, LB T776 LHGB T686 LT T68C, LB T68C - Hyper Mini TOPLED® LB M676 - Mini TOPLED Santana® LG M470 LS M47K, LO M47K, LY M47K Source: http://www.osram.convergy.de/
Q1 Q2 U7-U12 = Charles:BSS138: MOSFET N-CH 50V 220MA
R1-R43 = rcl:R-US_: RESISTOR, American symbol; SPICEPREFIX: R
S1-S5 = Charles:KMR731NG: Tactile Switch SPST-NO Top Actuated Surface Mount
SJ1-SJ13 SJ16-SJ18 = Charles:SOLDERJUMPER: SMD Solder JUMPER Solder the two pads together to create a connection, or remove the solder to break it. REFLOW - Use this footprint for solder paste and reflow ovens. WAVE - Use this footprint for hand-soldering (larger pads). CLOSED - Has a trace between the two pads to ensure it is closed by default. The trace needs to be cut to disable the jumper, and can be closed again by creating a solder bridge between the two pads.
U1 U3-U5 = Charles:TPS22917: 1 V–5.5-V, 2-A, 80-mΩ Ultra-Low Leakage Load Switch
U2 = Charles:SN74AVC4T774PWR: 4-Bit Dual-Supply Bus Transceiver With Configurable Voltage Translation and 3-State Outputs; MANUFACTURER_PART_NUMBER: SN74AVC4T774PWR; VENDOR: Texas Instruments
U6 = Charles:SARA-R404M
U14 = Charles:TPS6216X: 3-V to 17-V, 1-A Step-Down Converters with DCS-Control
U$1 = Charles:STM32L422RBT6: Ultra-low-power Arm® Cortex®-M4 32-bit MCU+FPU, 100DMIPS, 128KB Flash, 40KB SRAM, analog, AES
U$2 = Charles:AFS14: Frequency General Purpose RF SAW Filter (Sound Acoustic Wave) 5-SMD, No Lead; BANDWIDTH: 40MHz; FREQUENCY: 1575.42MHz; IL: 0.9dB
U$3 U$10 U$12-U$16 = Charles:INDUCTOR: Chip Inductor
U$4 = Charles:VLF3012ST-2R2M1R4: 2.2µH Shielded Wirewound Inductor 1.4A 72 mOhm Max Nonstandard
U$5 = Charles:SIM_SD_MOLEX
U$6 = James_Updated:MICRO_USB: Molex Micro USB AB RA SMD Bottom Mount
U$7 = Charles:SX1262: Semtech Long Range, Low Power, sub-GHz RF Transceiver (LoRa & FSK)
U$8 = Charles:MAX-8/M8: U-Blox IC RECEIVER GPS/GNSS 18LCC
U$9 = Charles:BGS12SN6E6327XTSA1: RF Switch IC Bluetooth, WLAN SPDT 6GHz 50Ohm TSNP-6-2
U$11 = Charles:BGA2803: RF Amplifier IC General Purpose 0Hz ~ 2.2GHz 6-TSSOP
U$17 = James_Updated:SPDT_THRU
X1 = adafruit:ANTENNA_U.FL: U.FL Antenna Connector
X2 X3 = adafruit:SMACONNECTOR: SMA Connector 90° DIP SMA Connector, 50 Ohm (4UConnector: 07259)
Y1 = SparkFun-Clocks:CRYSTAL-32MHZ: 32MHz Crystal Digikey Example <http://www.digikey.com/product-detail/en/murata-electronics-north-america/XRCGB32M000F2P00R0/490-9769-1-ND/4952013> Frequency: 32MHz Frequency Stability: ±20ppm Frequency Tolerance: ±20ppm Load Capacitance: 6pF SparkFun Products SparkFun nRF52832 Breakout <https://www.sparkfun.com/products/13990>; PROD_ID: XTAL-13459; VALUE: 32MHz

## Net classes
1 diff: width 0.305 mm, clearance 0.152 mm